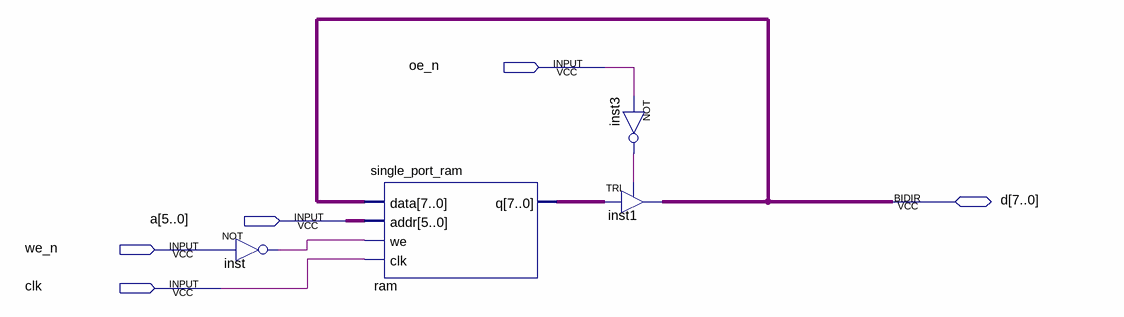
[diagram p0: schematic sheet]
// Quartus schematic RAM1.bdf as structural Verilog: 4 symbols, 5 pins
module RAM1 (
  input  oe_n,
  input  [5:0] a,
  input  we_n,
  input  clk,
  inout  [7:0] d
);

  wire inst3_out, inst_out;
  wire [7:0] ram_q;

  not inst (inst_out, we_n);
  single_port_ram ram (.data(d), .addr(a), .we(inst_out), .clk(clk), .q(ram_q));
  TRI inst1[7:0] (.IN(ram_q), .OE(inst3_out), .OUT(d));
  not inst3 (inst3_out, oe_n);
endmodule
